# Altium schematic sheet FiltroAntialiasing.SchDoc
size A4
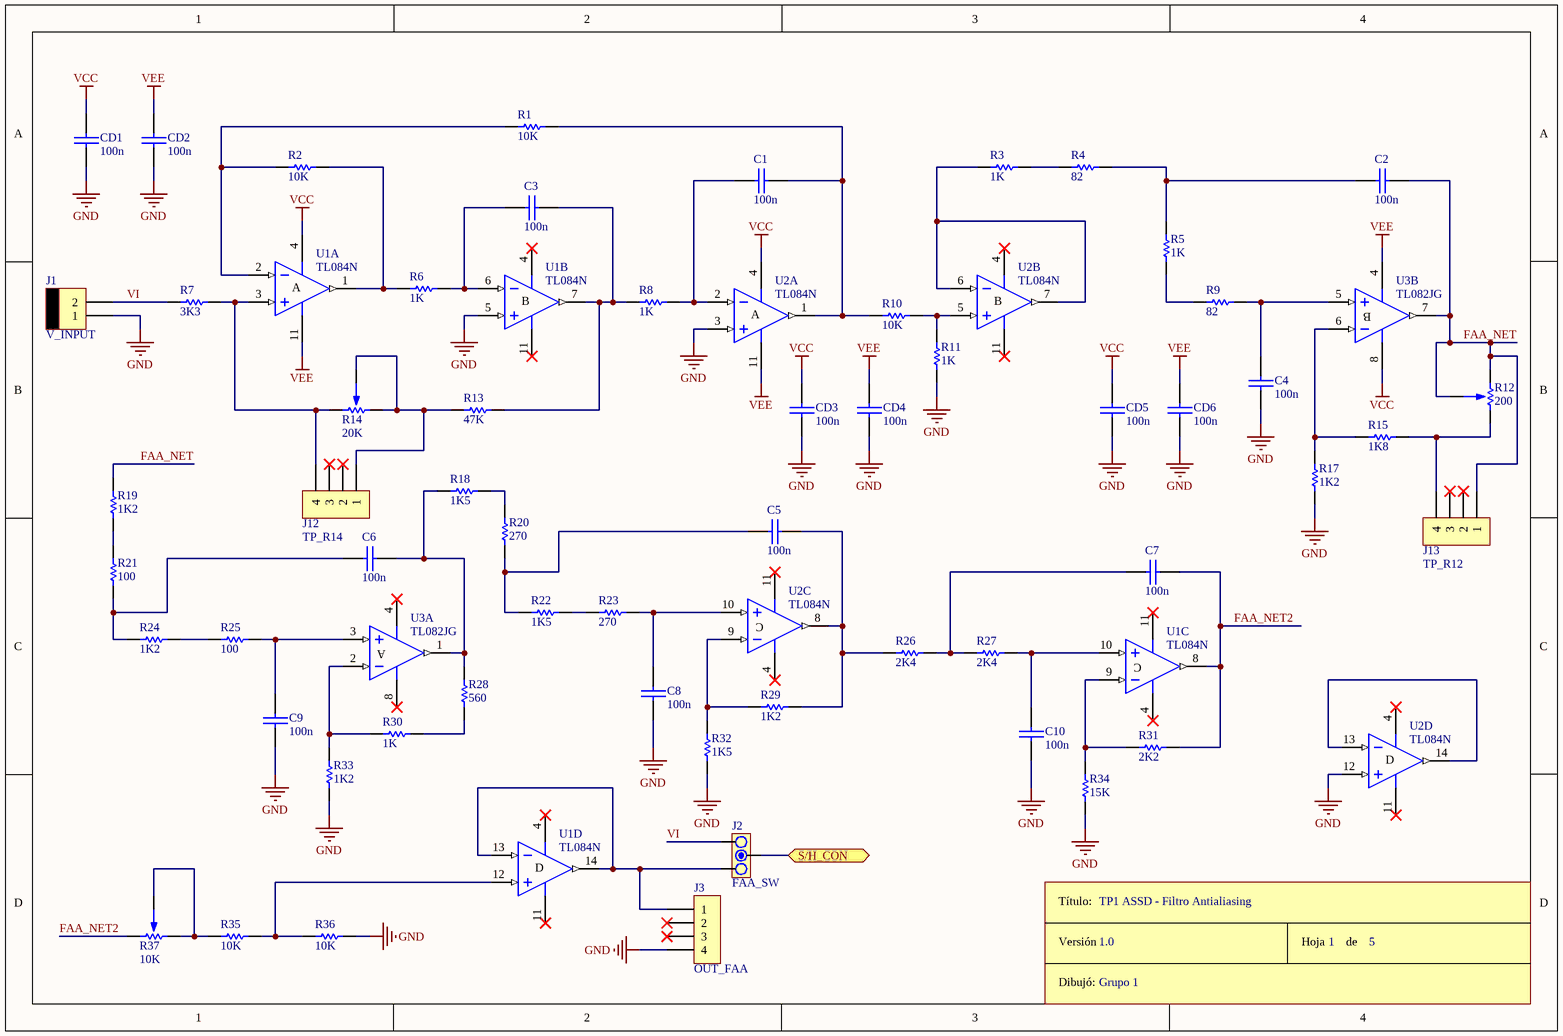
[diagram p0: FiltroAntialiasing.SchDoc]

## Parts
C1  100n  [CAP100]
C2  100n  [CAP100]
C3  100n  [CAP100]
C4  100n  [CAP100]
C5  100n  [CAP100]
C6  100n  [CAP100]
C7  100n  [CAP100]
C8  100n  [CAP100]
C9  100n  [CAP100]
C10  100n  [CAP100]
CD1  100n  [CAP100]
CD2  100n  [CAP100]
CD3  100n  [CAP100]
CD4  100n  [CAP100]
CD5  100n  [CAP100]
CD6  100n  [CAP100]
J1  V_INPUT  [MOLEX2]
J2  FAA_SW  [JUMPER3]
J3  OUT_FAA  [SIP4]
J12  TP_R14  [SIP4]
J13  TP_R12  [SIP4]
R1  10K  [RES400]
R2  10K  [RES400]
R3  1K  [RES400]
R4  82  [RES400]
R5  1K  [RES400]
R6  1K  [RES400]
R7  3K3  [RES400]
R8  1K  [RES400]
R9  82  [RES400]
R10  10K  [RES400]
R11  1K  [RES400]
R12  200  [PRESET V]
R13  47K  [RES400]
R14  20K  [PRESET V]
R15  1K8  [RES400]
R17  1K2  [RES400]
R18  1K5  [RES400]
R19  1K2  [RES400]
R20  270  [RES400]
R21  100  [RES400]
R22  1K5  [RES400]
R23  270  [RES400]
R24  1K2  [RES400]
R25  100  [RES400]
R26  2K4  [RES400]
R27  2K4  [RES400]
R28  560  [RES400]
R29  1K2  [RES400]
R30  1K  [RES400]
R31  2K2  [RES400]
R32  1K5  [RES400]
R33  1K2  [RES400]
R34  15K  [RES400]
R35  10K  [RES400]
R36  10K  [RES400]
R37  10K  [PRESET V]
ROT1  Rótulo  (value not drawn)
U1  TL084N  [N014]  (parts A,B,C,D of 4)
U2  TL084N  [N014]  (parts A,B,C,D of 4)
U3  TL082JG  [JG008]  (parts A,B of 2)

## Ports
S/H_CON

## Nets
GND: C4.2 C8.2 C9.1 C10.2 CD1.2 CD2.2 CD3.2 CD4.2 CD5.2 CD6.2 J1.1 J3.4 R11.1 R17.1 R32.1 R33.1 R34.1 R36.1 U1.5(IN+) U2.3(IN+) U2.12(IN+)
VCC: CD1.1 CD3.1 CD5.1 U1.4(V+) U2.4(V+) U3.8(V+)
VEE: CD2.1 CD4.1 CD6.1 U1.11(V-) U2.11(V-) U3.4(V-)
FAA_NET: C2.2 J13.1 R12.2 R12.3 R19.1 U3.7(OUT)
FAA_NET2: C7.2 R31.2 R37.1 U1.8(OUT)
S/H_CON: J2.2 ; port S/H_CON
VI: J1.2 J2.3 R7.1
NetC1_1: C1.1 R8.2 U2.2(IN-)
NetC1_2: C1.2 R1.2 R10.1 U2.1(OUT)
NetC2_1: C2.1 R4.2 R5.2
NetC3_1: C3.1 R6.2 U1.6(IN-)
NetC3_2: C3.2 R8.1 R13.2 U1.7(OUT)
NetC4_1: C4.1 R9.2 U3.5(IN+)
NetC5_1: C5.1 R20.2 R22.1
NetC5_2: C5.2 R26.1 R29.2 U2.8(OUT)
NetC6_1: C6.1 R21.2 R24.1
NetC6_2: C6.2 R18.2 R28.2 U3.1(OUT)
NetC7_1: C7.1 R26.2 R27.1
NetC8_1: C8.1 R23.2 U2.10(IN+)
NetC9_2: C9.2 R25.2 U3.3(IN+)
NetC10_1: C10.1 R27.2 U1.10(IN+)
NetJ2_1: J2.1 J3.1 U1.13(IN-) U1.14(OUT)
NetJ12_1: J12.1 R13.1 R14.2 R14.3
NetJ12_4: J12.4 R7.2 R14.1 U1.3(IN+)
NetJ13_4: J13.4 R12.1 R15.2
NetR1_1: R1.1 R2.1 U1.2(IN-)
NetR2_2: R2.2 R6.1 U1.1(OUT)
NetR3_1: R3.1 R4.1
NetR3_2: R3.2 U2.6(IN-) U2.7(OUT)
NetR5_1: R5.1 R9.1
NetR10_2: R10.2 R11.2 U2.5(IN+)
NetR15_1: R15.1 R17.2 U3.6(IN-)
NetR18_1: R18.1 R20.1
NetR19_2: R19.2 R21.1
NetR22_2: R22.2 R23.1
NetR24_2: R24.2 R25.1
NetR28_1: R28.1 R30.2
NetR29_1: R29.1 R32.2 U2.9(IN-)
NetR30_1: R30.1 R33.2 U3.2(IN-)
NetR31_1: R31.1 R34.2 U1.9(IN-)
NetR35_1: R35.1 R37.2 R37.3
NetR35_2: R35.2 R36.2 U1.12(IN+)
NetU2_13: U2.13(IN-) U2.14(OUT)

Not connected (* = marked no-connect by the designer): J3 2* 3*; J12 2* 3*; J13 2* 3*

## Notes on the sheet
- TP1 ASSD - Filtro Antialiasing
- 1.0
- Grupo 1
- 1
- 5
- (in symbol Rótulo) Título:; Versión; Hoja       de; Dibujó:
- (in symbol TL082JG, part A) A
- (in symbol TL082JG, part B) B
- (in symbol TL084N, part A) A
- (in symbol TL084N, part B) B
- (in symbol TL084N, part C) C
- (in symbol TL084N, part D) D

## Library data of the parts
C1-C10 CD1-CD6 = CAP
J1 = MOLEX2
J2 = JUMPER3
J3 J12 J13 = CON4
R1-R11 R13 R15 R17-R36 = RES
R12 R14 R37 = PRESET
U1 U2 = TL084N: JFET-Input Operational Amplifier; Published: 16-Jan-2001; LatestRevisionDate: 04-Mar-2005; LatestRevisionNote: Stylized 3D Model Added.; DatasheetVersion: Feb-1999; PackageVersion: Oct-1995; PackageReference: N014; Publisher: Altium Limited; PackageDescription: DIP; 14 Leads; Row Spacing 7.62 mm; Pitch 2.54 mm; ComponentLink1Description: Manufacturer Link; ComponentLink1URL: http://www.ti.com/; ComponentLink2Description: Datasheet; ComponentLink2URL: http://www-s.ti.com/sc/ds/tl084.pdf
U3 = TL082JG: JFET-Input Operational Amplifier; Published: 16-Jan-2001; LatestRevisionDate: 04-Mar-2005; LatestRevisionNote: Stylized 3D Model Added.; DatasheetVersion: Feb-1999; PackageVersion: Jan-1995; PackageReference: JG008; Publisher: Altium Limited; PackageDescription: DIP; 8 Leads; Row Spacing 7.62 mm; Pitch 2.54 mm; ComponentLink1Description: Manufacturer Link; ComponentLink1URL: http://www.ti.com/; ComponentLink2Description: Datasheet; ComponentLink2URL: http://www-s.ti.com/sc/ds/tl082.pdf